# EAGLE design PuenteH (EAGLE 9.3.2)
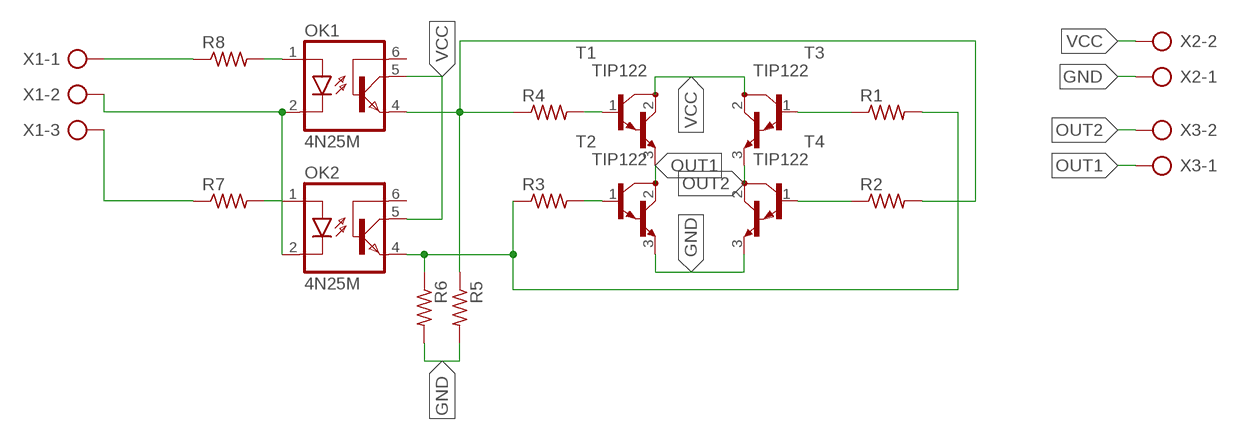
[diagram p0: schematic, sheet 1]

## Parts
OK1  4N25M  [DIL06]
OK2  4N25M  [DIL06]
R1  R-US_0207/12  [0207/12]
R2  R-US_0207/12  [0207/12]
R3  R-US_0207/12  [0207/12]
R4  R-US_0207/12  [0207/12]
R5  R-US_0207/12  [0207/12]
R6  R-US_0207/12  [0207/12]
R7  R-US_0207/12  [0207/12]
R8  R-US_0207/12  [0207/12]
T1  TIP122  [TO220]
T2  TIP122  [TO220]
T3  TIP122  [TO220]
T4  TIP122  [TO220]
X1  AK500/3-H  [AK500/3-H]
X2  AK500/2-H  [AK500/2-H]
X3  AK500/2-H  [AK500/2-H]

## Nets
GND: R5.2 R6.2 T2.3(E) T4.3(E) X2.1
N$1: R4.2 T1.1(B)
N$2: R3.2 T2.1(B)
N$5: R1.1 T3.1(B)
N$6: R2.1 T4.1(B)
N$7: OK2.4(EMI) R1.2 R3.1 R6.1
N$9: OK1.4(EMI) R2.2 R4.1 R5.1
N$14: OK1.1(A) R8.2
N$15: OK2.1(A) R7.2
N$16: OK1.2(C) OK2.2(C) X1.2
N$17: R7.1 X1.3
N$18: R8.1 X1.1
OUT1: T1.3(E) T2.2(C) X3.1
OUT2: T3.3(E) T4.2(C) X3.2
VCC: OK1.5(COL) OK2.5(COL) T1.2(C) T3.2(C) X2.2
Unconnected: OK1.6(BAS) OK2.6(BAS)

## Library data of the parts
OK1 OK2 = optocoupler:4N*?M: General Purpose 6-Pin Phototransistor Optocouplers Source: http://www.fairchildsemi.com/ds/4N/4N35-M.pdf; MPN: 4N25-M; OC_FARNELL: 1021349; OC_NEWARK: 98K9084
R1-R8 = rcl:R-US_: RESISTOR, American symbol; SPICEPREFIX: R
T1-T4 = transistor:TIP122: NPN BIPOLAR DARLINGTON TRANSISTOR
X1 = con-ptr500:AK500/3-H: CONNECTOR Aug. 2004 / PTR Meßtechnik: Die Bezeichnung der Serie AK505 wurde geändert. Es handelt sich hierbei um AK500 in horizontaler Ausführung.; OC_FARNELL: unknown; OC_NEWARK: unknown
X2 X3 = con-ptr500:AK500/2-H: CONNECTOR Aug. 2004 / PTR Meßtechnik: Die Bezeichnung der Serie AK505 wurde geändert. Es handelt sich hierbei um AK500 in horizontaler Ausführung.; OC_FARNELL: unknown; OC_NEWARK: unknown

## Board
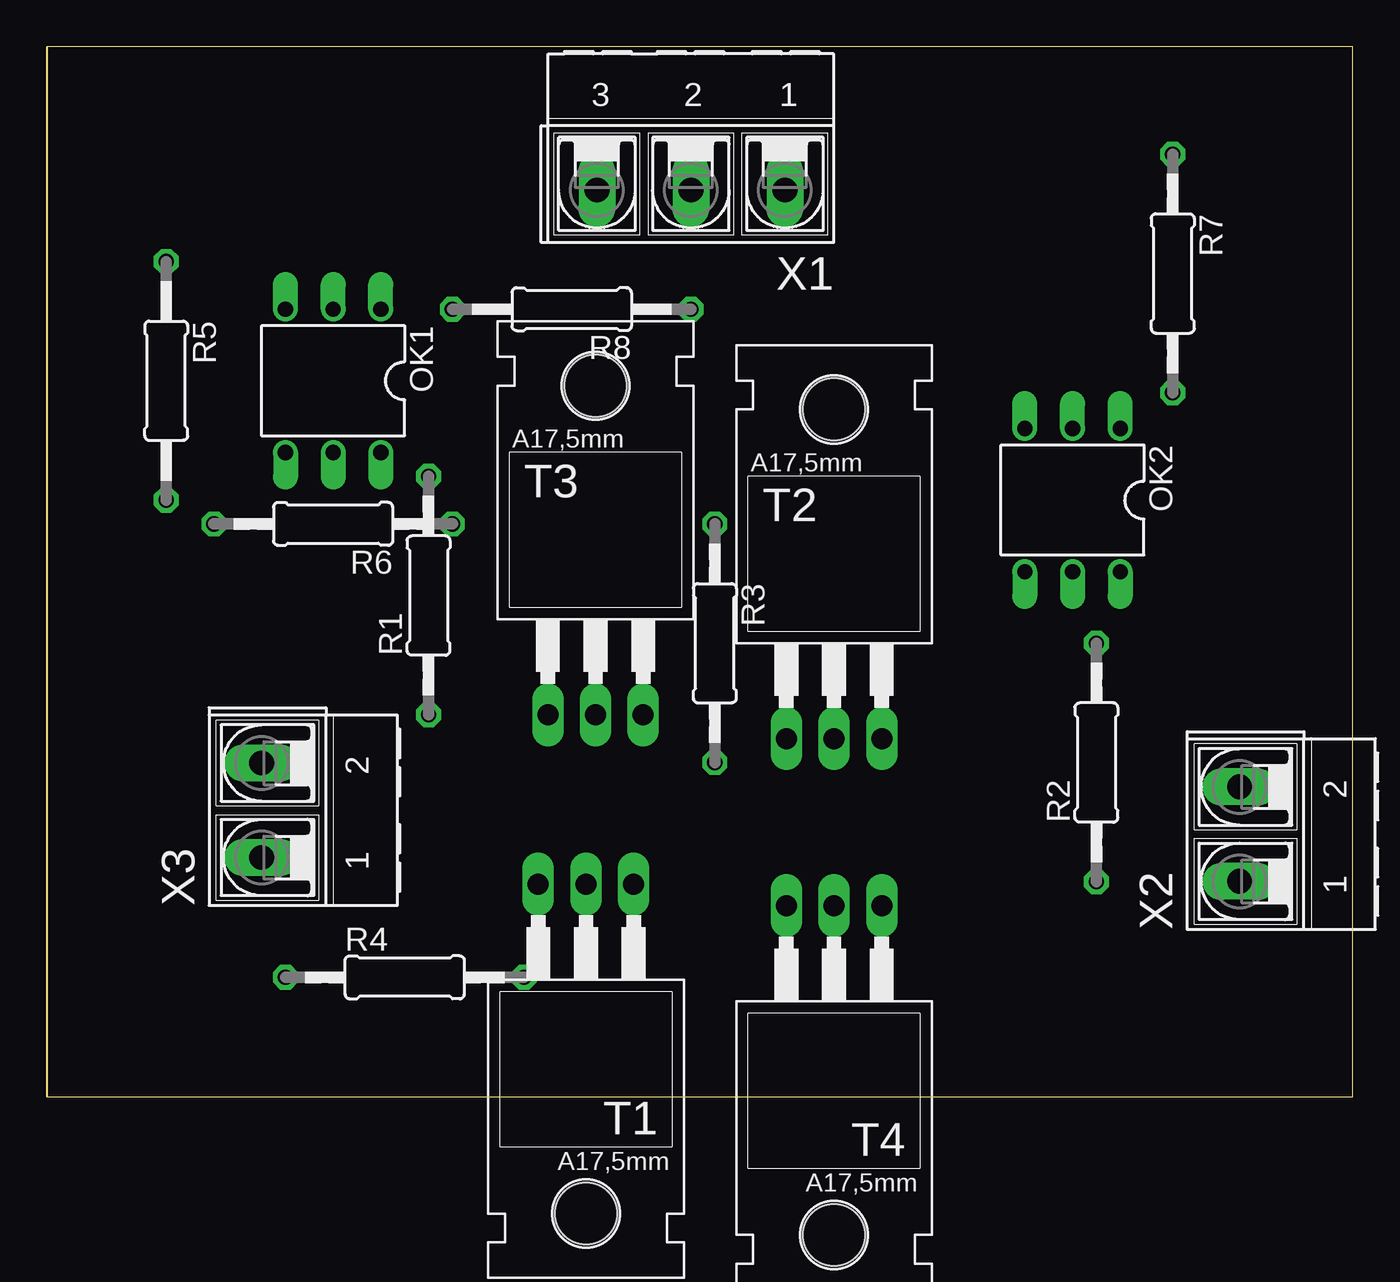
[diagram p1: board, top side]
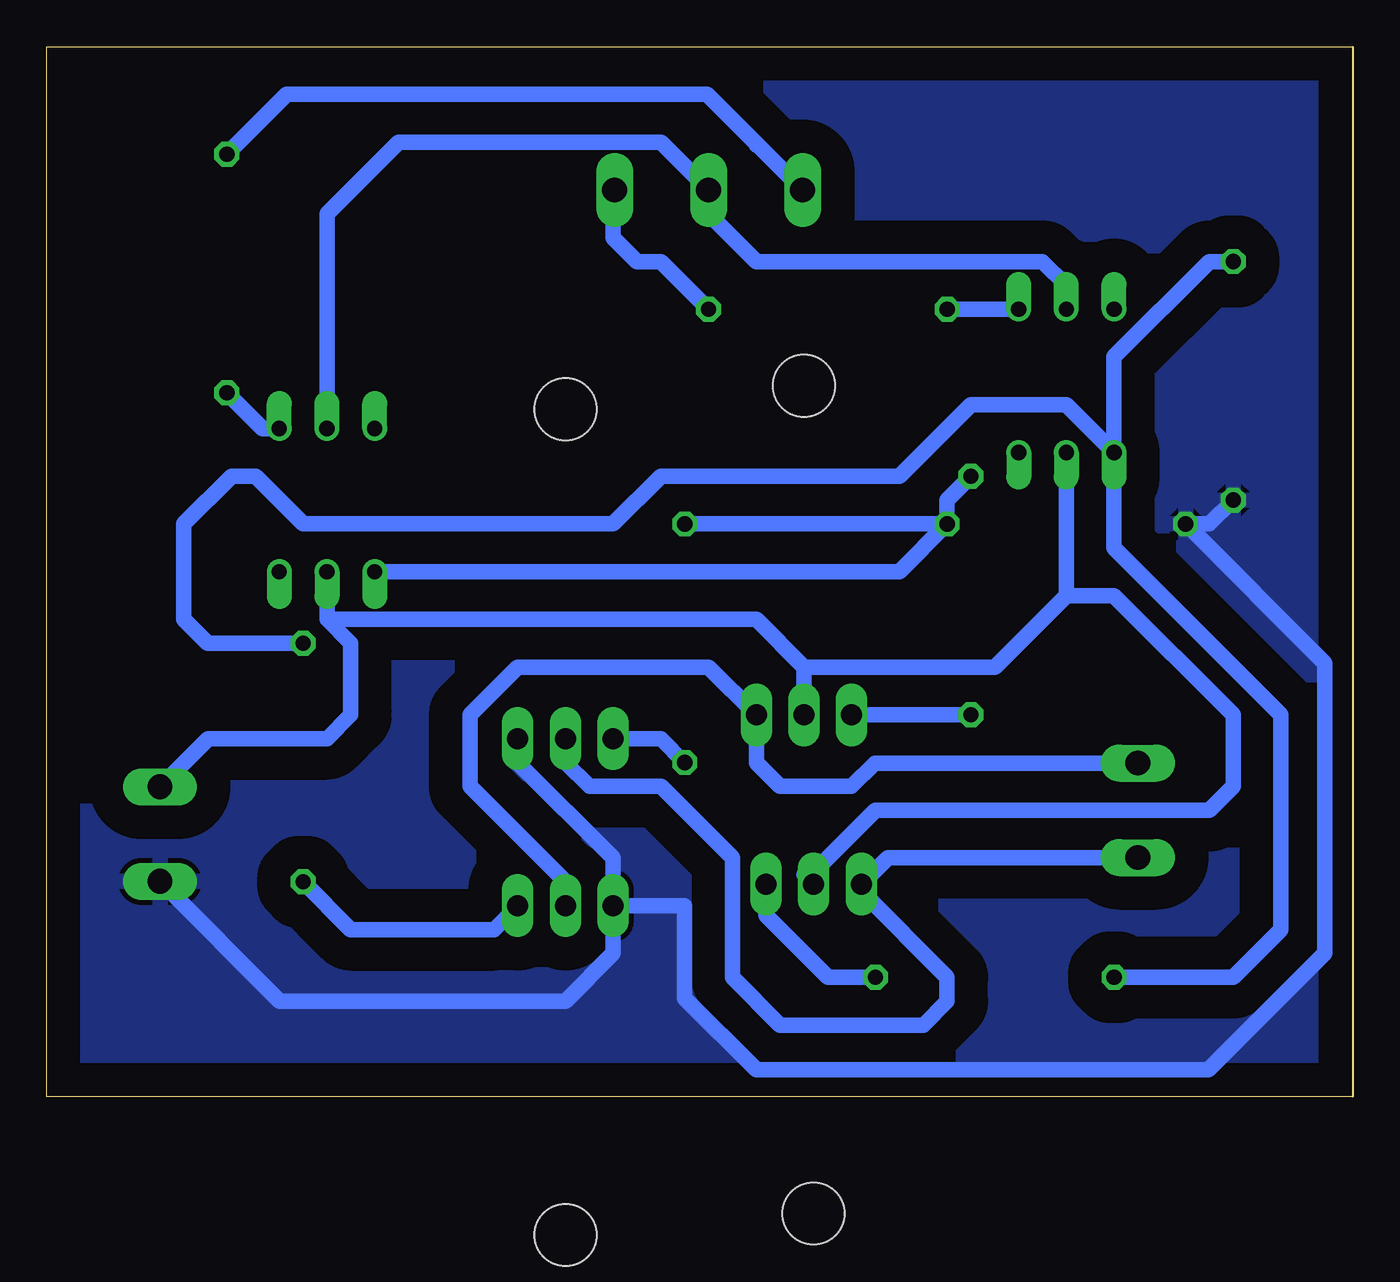
[diagram p2: board, bottom side, seen from below]

Size 69.52 x 55.87 mm. Coordinates in mm from the lower left corner, seen from the top.
Outline: 0,0 69.52,0 69.52,55.87 0,55.87 0,0
Copper layers (1*16): Top 0.035mm / dielectric 1.5mm / Bottom 0.035mm
Design rules "default": minimum track width 6mil, minimum drill 0.35mm, track to track 6mil, track to pad 6mil, pad to pad 6mil, via to via 6mil, smd to smd 6mil, copper to edge 40mil, drill to drill 6mil, minimum pad ring 10mil, minimum via ring 8mil, stop-mask expansion 4mil, vias tented up to drill 0mil, thermal gap 10mil

### Footprints (pad centres in the part's own frame; a part is rotated, then mirrored left to right if it is on the bottom)
DIL06 = drill 0.813 offset: 1 -2.54,-3.81; 2 0,-3.81; 3 2.54,-3.81; 4 2.54,3.81; 5 0,3.81; 6 -2.54,3.81
0207/12 = drill 0.813 octagon: 1 -6.35,0; 2 6.35,0
TO220 = drill 1.118 long: 1 -2.54,-6.35; 2 0,-6.35; 3 2.54,-6.35 | hole 3.302: 0,11.176
AK500/3-H = drill 1.321 long: 1 -5.004,0; 2 0,0; 3 5.004,0
AK500/2-H = drill 1.321 long: 1 -2.515,0; 2 2.515,0

### Placement (x,y rotation side)
OK1  15.24,38.1 180 top
OK2  54.61,31.75 180 top
R1  20.32,26.67 90 top
R2  55.88,17.78 90 top
R3  35.56,24.13 270 top
R4  19.05,6.35 0 top
R5  6.35,38.1 270 top
R6  15.24,30.48 180 top
R7  59.94,43.81 270 top
R8  27.94,41.91 180 top
T1  28.7,4.95 180 top
T2  41.91,25.4 0 top
T3  29.21,26.67 0 top
T4  41.91,3.81 180 top
X1  34.29,48.26 180 top
X2  63.5,13.97 90 top
X3  11.43,15.24 90 top

### Tracks (layer width: path | path; a pad name or v marks a point on that pad's centre or on a via)
GND
  Bottom 0.813: R5.2 7.62,30.48 R6.2 1.47,23.06 1.47,7.62 7.67,1.42 31.75,1.42 35.56,5.23 35.56,10.16 T4.3 | T2.3 44.45,17.78 39.37,12.7 T4.3 | X2.1 57.12,5.08 41.91,5.08 39.37,7.62 T4.3
  pour Bottom (isolate 1.778): 0,55.88 0,0 69.85,0 69.85,55.88
N$1
  Bottom 0.813: T1.1 31.24,9.65 27.94,6.35 R4.2
N$2
  Bottom 0.813: T2.1 36.83,19.05 R3.2
N$5
  Bottom 0.813: T3.1 R1.1
N$6
  Bottom 0.813: T4.1 45.72,8.89 53.34,8.89 R2.1
N$7
  Bottom 0.813: OK2.4 24.13,27.94 R6.1 | R6.1 21.59,31.75 R1.2 | R3.1 R6.1
N$9
  Bottom 0.813: OK1.4 12.7,39.37 7.62,44.45 R5.1 | OK1.4 15.24,36.83 20.32,36.83 24.13,33.02 36.83,33.02 39.37,30.48 55.88,30.48 58.42,33.02 59.69,33.02 62.23,30.48 62.23,25.4 60.96,24.13 R2.2 | R4.1 6.35,6.35 3.81,8.89 3.81,20.32 12.7,29.21 OK1.4
N$14
  Bottom 0.813: R8.2 OK1.1
N$15
  Bottom 0.813: OK2.1 58.04,35.56 R7.2
N$16
  Bottom 0.813: OK2.2 54.61,46.99 50.8,50.8 36.83,50.8 X1.2 34.29,46.99 31.75,44.45 16.51,44.45 15.24,43.18 OK1.2
N$17
  Bottom 0.813: X1.3 31.66,50.64 | 31.66,50.64 31.75,50.64 | 31.66,50.64 34.37,53.34 56.77,53.34 R7.1
N$18
  Bottom 0.813: X1.1 39.37,48.26 39.37,45.72 38.1,44.45 36.83,44.45 R8.1
OUT1
  Bottom 0.813: X3.1 24.74,12.73 T1.3 26.16,10.92 21.59,6.35 21.59,5.08 22.86,3.81 30.48,3.81 33.02,6.35 33.02,12.7 36.83,16.51 40.64,16.51 41.91,17.78 T2.2
OUT2
  Bottom 0.813: T4.2 41.91,11.43 46.99,16.51 46.99,20.32 44.45,22.86 34.29,22.86 T3.3 31.75,17.78 30.48,16.51 26.67,16.51 25.43,17.75 X3.2
VCC
  Bottom 0.813: X2.2 60.94,19.05 54.61,19.05 53.34,20.32 53.34,24.13 54.61,25.4 | 54.61,25.4 OK2.5 | 29.21,11.81 T1.2 28.7,11.94 25.4,15.24 7.62,15.24 6.35,16.51 6.35,20.32 12.7,26.67 15.24,26.67 | 15.24,26.67 19.05,22.86 29.21,22.86 | 15.24,26.67 OK1.5 | 29.21,22.86 31.75,25.4 54.61,25.4 | T3.2 29.21,22.86